# Altium project AC_board.PrjPcb
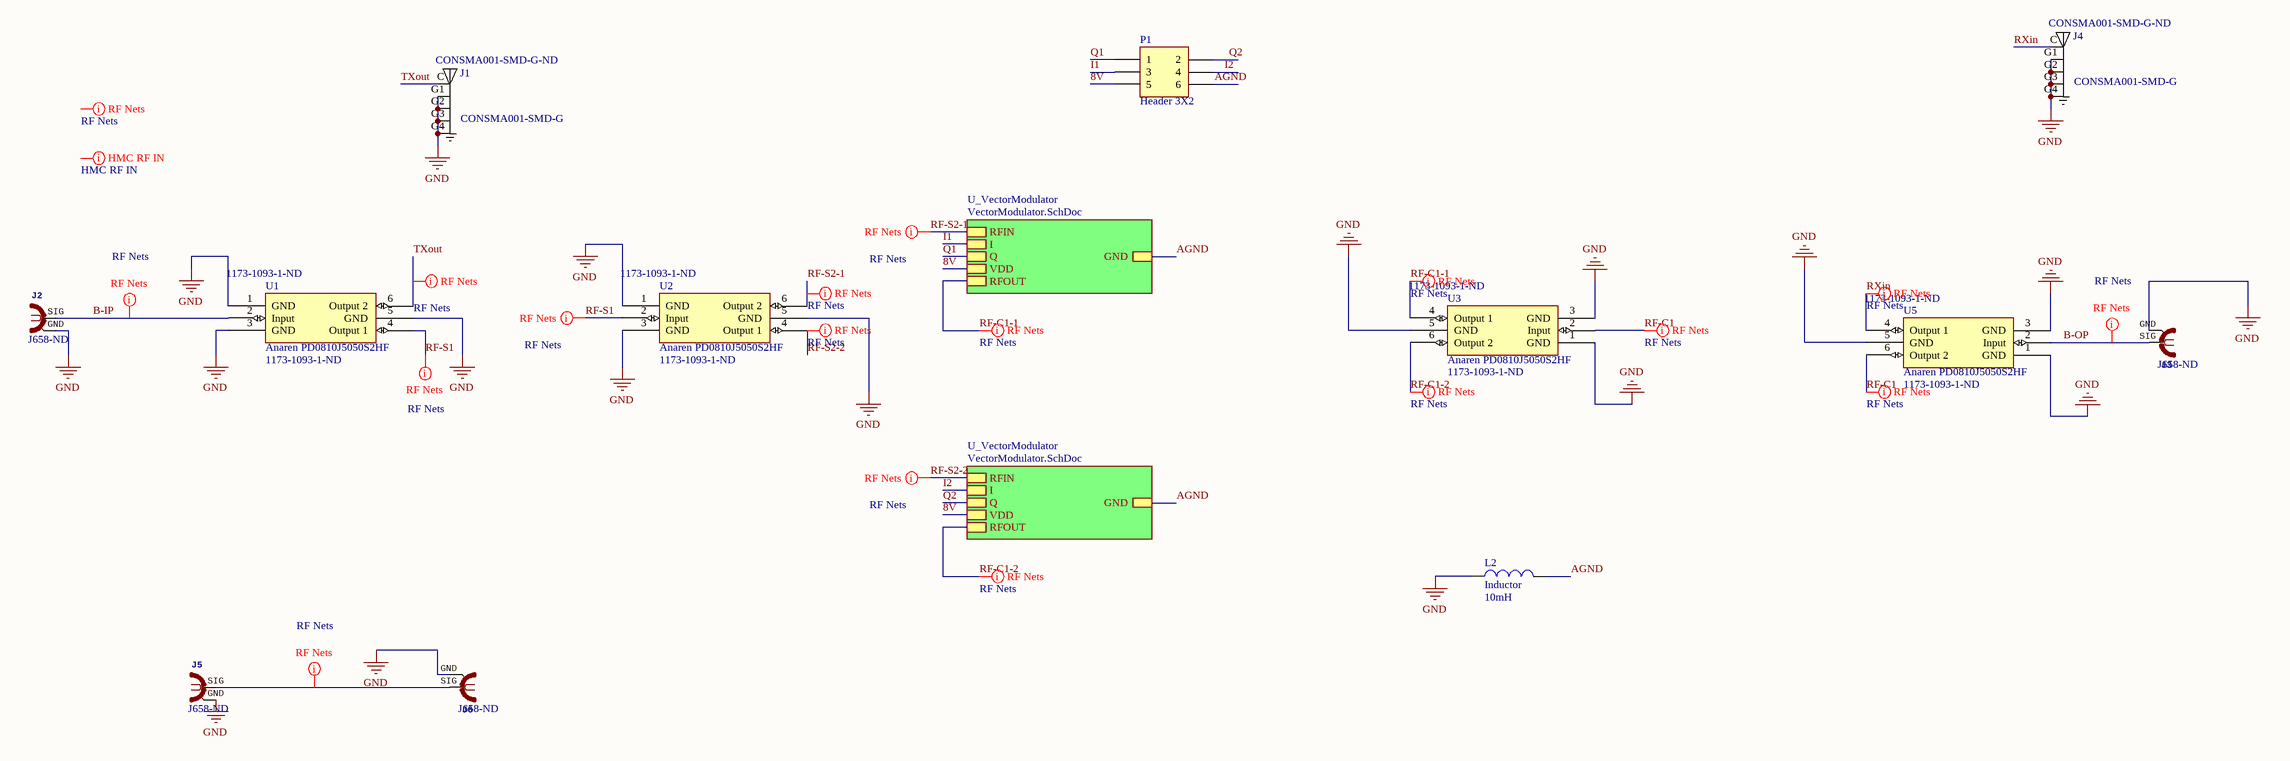
[diagram p0: AC_board.SchDoc]
2 sheets, 28 parts. Net scope: hierarchical (ports join the sheet entries above them; power ports are global).
Board file: AC_board.PcbDoc
Sheets:
  AC_board.SchDoc
    U_VectorModulator = VectorModulator.SchDoc
    U_VectorModulator = VectorModulator.SchDoc

## Sheet AC_board.SchDoc
size OrCAD E

### Parts
J1  CONSMA001-SMD-G  Supplier Part Number 1: CONSMA001-SMD-G-ND  [*LINX_CONSMA001-SMD-G_CONSMA001-SMD-G(Primary)]
J2  Supplier Part Number 1: J658-ND  [SMA-OSHPARK-4L-1.6MM- ALT3]  (hidden comment: SMA 50 Ohm edge)
J3  Supplier Part Number 1: J658-ND  [SMA-OSHPARK-4L-1.6MM- ALT3]  (hidden comment: SMA 50 Ohm edge)
J4  CONSMA001-SMD-G  Supplier Part Number 1: CONSMA001-SMD-G-ND  [*LINX_CONSMA001-SMD-G_CONSMA001-SMD-G(Primary)]
J5  Supplier Part Number 1: J658-ND  [SMA-OSHPARK-4L-1.6MM- ALT3]  (hidden comment: SMA 50 Ohm edge)
J6  Supplier Part Number 1: J658-ND  [SMA-OSHPARK-4L-1.6MM- ALT3]  (hidden comment: SMA 50 Ohm edge)
L2  Inductor  value 10mH  [0402-A]
P1  Header 3X2  [HDR2X3]
U1  Anaren PD0810J5050S2HF  U*: 1173-1093-1-ND  [*ANAREN_PD0409J7575S2HF]
U2  Anaren PD0810J5050S2HF  U*: 1173-1093-1-ND  [*ANAREN_PD0409J7575S2HF]
U3  Anaren PD0810J5050S2HF  U*: 1173-1093-1-ND  [*ANAREN_PD0409J7575S2HF]
U5  Anaren PD0810J5050S2HF  U*: 1173-1093-1-ND  [*ANAREN_PD0409J7575S2HF]

### Sub-sheets
U_VectorModulator = VectorModulator.SchDoc: RFIN, I, Q, VDD, RFOUT, GND
U_VectorModulator = VectorModulator.SchDoc: RFIN, I, Q, VDD, RFOUT, GND

### Nets
AGND: J1.G1(GND) J1.G2(GND) J1.G3(GND) J1.G4(GND) J2.GND J3.GND J4.G1(GND) J4.G2(GND) J4.G3(GND) J4.G4(GND) J5.GND J6.GND L2.1 L2.2 P1.6 U1.1(GND) U1.3(GND) U1.5(GND) U2.1(GND) U2.3(GND) U2.5(GND) U3.1(GND) U3.3(GND) U3.5(GND) U5.1(GND) U5.3(GND) U5.5(GND) ; sheet U_VectorModulator/GND, sheet U_VectorModulator/GND  [also labelled GND]
8V: P1.5 ; sheet U_VectorModulator/VDD, sheet U_VectorModulator/VDD
B-IP: J2.SIG U1.2(Input)
B-OP: J3.SIG U5.2(Input)
I1: P1.3 ; sheet U_VectorModulator/I
I2: P1.4 ; sheet U_VectorModulator/I
Q1: P1.1 ; sheet U_VectorModulator/Q
Q2: P1.2 ; sheet U_VectorModulator/Q
RF-C1: U3.2(Input) U5.6(Output_2)
RF-C1-1: U3.4(Output_1) ; sheet U_VectorModulator/RFOUT
RF-C1-2: U3.6(Output_2) ; sheet U_VectorModulator/RFOUT
RF-S1: U1.4(Output_1) U2.2(Input)
RF-S2-1: U2.6(Output_2) ; sheet U_VectorModulator/RFIN
RF-S2-2: U2.4(Output_1) ; sheet U_VectorModulator/RFIN
RXin: J4.C(FEEDING) U5.4(Output_1)
TXout: J1.C(FEEDING) U1.6(Output_2)
NetJ5_SIG: J5.SIG J6.SIG

### Layout directives
net class RF Nets; rule Width MAXLIMIT=15.948mil MINLIMIT=15.948mil PREFEREDWIDTH=15.948mil; rule Clearance GAP=20mil: (no net found under the mark), B-IP, B-OP, NetJ5_SIG, RF-C1, RF-C1-1, RF-C1-2, RF-S1, RF-S2-1, RF-S2-2, RXin, TXout
net class HMC RF IN; rule Clearance GAP=5mil; rule Width MAXLIMIT=11.833mil MINLIMIT=11.833mil PREFEREDWIDTH=11.833mil: (no net found under the mark)

### Library data of the parts
J1 J4 = CONSMA001-SMD-G: 50 Ohm Gold Plated Female PCB Mount SMA Connector; MF: Linx Technologies; Package: None; Digi-Key_Part_Number: CONSMA001-SMD-G-ND; SnapEDA_Link: https://www.snapeda.com/parts/CONSMA001-SMD-G/Linx%20Technologies%20Inc./view-part/?ref=snap; Digi-Key_Purchase_URL: https://www.digikey.com/product-detail/en/linx-technologies-inc/CONSMA001-SMD-G/CONSMA001-SMD-G-ND/4496569?utm_source=snapeda&utm_medium=aggregator&utm_campaign=symbol; MP: CONSMA001-SMD-G; Value: *; Supplier 1: Digi-Key
J2 J3 J5 J6 = SMA-OSHPARK-4L-1.6MM-ALT3: GateName_1: G1; SymbolName_1: COAX; DeviceName: -OSHPARK-4L-1.6MM; LibraryName: dword1511-connectors; DeviceSetName: SMA; Package: SMA-OSHPARK-4L-1.6MM; Supplier 1: Digi-Key
L2 = Inductor: Code_IEC: 1005; Published: 8-Jun-2000; LatestRevisionDate: 29-May-2009; LatestRevisionNote: IPC-7351 Footprint Added.; PackageReference: 0402-A; Publisher: Altium Limited; PackageDescription: Chip Inductor; Code_JEITA: 0402
P1 = Header 3X2: Header, 3-Pin, Dual row; LatestRevisionDate: 17-Jul-2002; LatestRevisionNote: Re-released for DXP Platform.; Publisher: Altium Limited
U1-U3 U5 = Anaren PD0810J5050S2HF: Supplier 1: Digi-Key; Supplier Part Number 1: 1173-1093-1-ND

## Sheet VectorModulator.SchDoc
size OrCAD E
Used 2 times, as channels U_VectorModulator, U_VectorModulator. Parts and nets are listed once, with the designators drawn on the sheet.
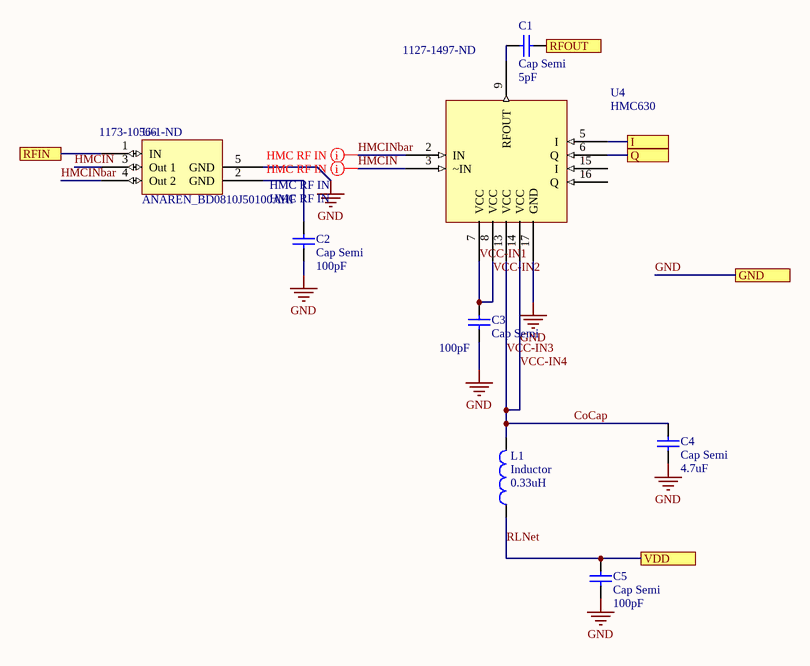
[diagram p1: VectorModulator.SchDoc]

### Parts
C1  Cap Semi  value 5pF  [0402]
C2  Cap Semi  value 100pF  [0402]
C3  Cap Semi  value 100pF  [0402]
C4  Cap Semi  value 4.7uF  [0402]
C5  Cap Semi  value 100pF  [0402]
L1  Inductor  value 0.33uH  [0402-A]
U4  HMC630  Supplier Part Number 1: 1127-1497-ND  [*QFN50P300X300X100-17N]
U6  ANAREN_BD0810J50100AHF  Supplier Part Number 1: 1173-1056-1-ND  [*ANAREN_PD0409J7575S2HF]

### Ports
GND, I, Q, RFIN, RFOUT, VDD

### Nets
GND: C2.1 C3.1 C4.1 C5.1 U4.17(GND) U6.5(GND) ; port GND
CoCap: C4.2 L1.2 U4.13(VCC) U4.14(VCC)  [also labelled VCC-IN3, VCC-IN4]
HMCIN: U4.3(~IN) U6.3(Out_1)
HMCINbar: U4.2(IN) U6.4(Out_2)
I: U4.5(I) ; port I
Q: U4.6(Q) ; port Q
RFIN: U6.1(IN) ; port RFIN
RFOUT: C1.2 ; port RFOUT
RLNet: C5.2 L1.1 ; port VDD
VCC-IN1: C3.2 U4.7(VCC) U4.8(VCC)  [also labelled VCC-IN2]
NetC1_1: C1.1 U4.9(RFOUT)
NetC2_2: C2.2 U6.2(GND)

Not connected (* = marked no-connect by the designer): U4 15(I) 16(Q)

### Channels
U_VectorModulator: designators end in _U_VectorModulator2; ports GND=AGND I=I1 Q=Q1 RFIN=RF-S2-1 RFOUT=RF-C1-1 VDD=8V
U_VectorModulator: designators end in _U_VectorModulator1; ports GND=AGND I=I2 Q=Q2 RFIN=RF-S2-2 RFOUT=RF-C1-2 VDD=8V

### Layout directives
net class HMC RF IN; rule Clearance GAP=5mil; rule Width MAXLIMIT=11.833mil MINLIMIT=11.833mil PREFEREDWIDTH=11.833mil: HMCIN_U_VectorModulator, HMCINbar_U_VectorModulator

### Library data of the parts
C1-C5 = Cap Semi: Capacitor (Semiconductor SIM Model); Published: 8-Jun-2000; LatestRevisionDate: 29-May-2009; LatestRevisionNote: IPC-7351 Footprint Added.; PackageReference: C1206; Publisher: Altium Limited; PackageDescription: Chip Capacitor
L1 = Inductor: Code_IEC: 1005; Published: 8-Jun-2000; LatestRevisionDate: 29-May-2009; LatestRevisionNote: IPC-7351 Footprint Added.; PackageReference: 0402-A; Publisher: Altium Limited; PackageDescription: Chip Inductor; Code_JEITA: 0402
U4 = HMC630: Supplier 1: Digi-Key
U6 = ANAREN_BD0810J50100AHF: Supplier 1: Digi-Key

## Nets that join several sheets
AGND: AC_board (27 pins), U_VectorModulator (6 pins), U_VectorModulator (6 pins)
8V: AC_board (P1.5), U_VectorModulator (C5_U_VectorModulator2.2 L1_U_VectorModulator2.1), U_VectorModulator (C5_U_VectorModulator1.2 L1_U_VectorModulator1.1)
I1: AC_board (P1.3), U_VectorModulator (U4_U_VectorModulator2.5)
I2: AC_board (P1.4), U_VectorModulator (U4_U_VectorModulator1.5)
Q1: AC_board (P1.1), U_VectorModulator (U4_U_VectorModulator2.6)
Q2: AC_board (P1.2), U_VectorModulator (U4_U_VectorModulator1.6)
RF-C1-1: AC_board (U3.4), U_VectorModulator (C1_U_VectorModulator2.2)
RF-C1-2: AC_board (U3.6), U_VectorModulator (C1_U_VectorModulator1.2)
RF-S2-1: AC_board (U2.6), U_VectorModulator (U6_U_VectorModulator2.1)
RF-S2-2: AC_board (U2.4), U_VectorModulator (U6_U_VectorModulator1.1)